# EAGLE design SE880_module_EFM32LG-STK3600 (EAGLE 6.4)
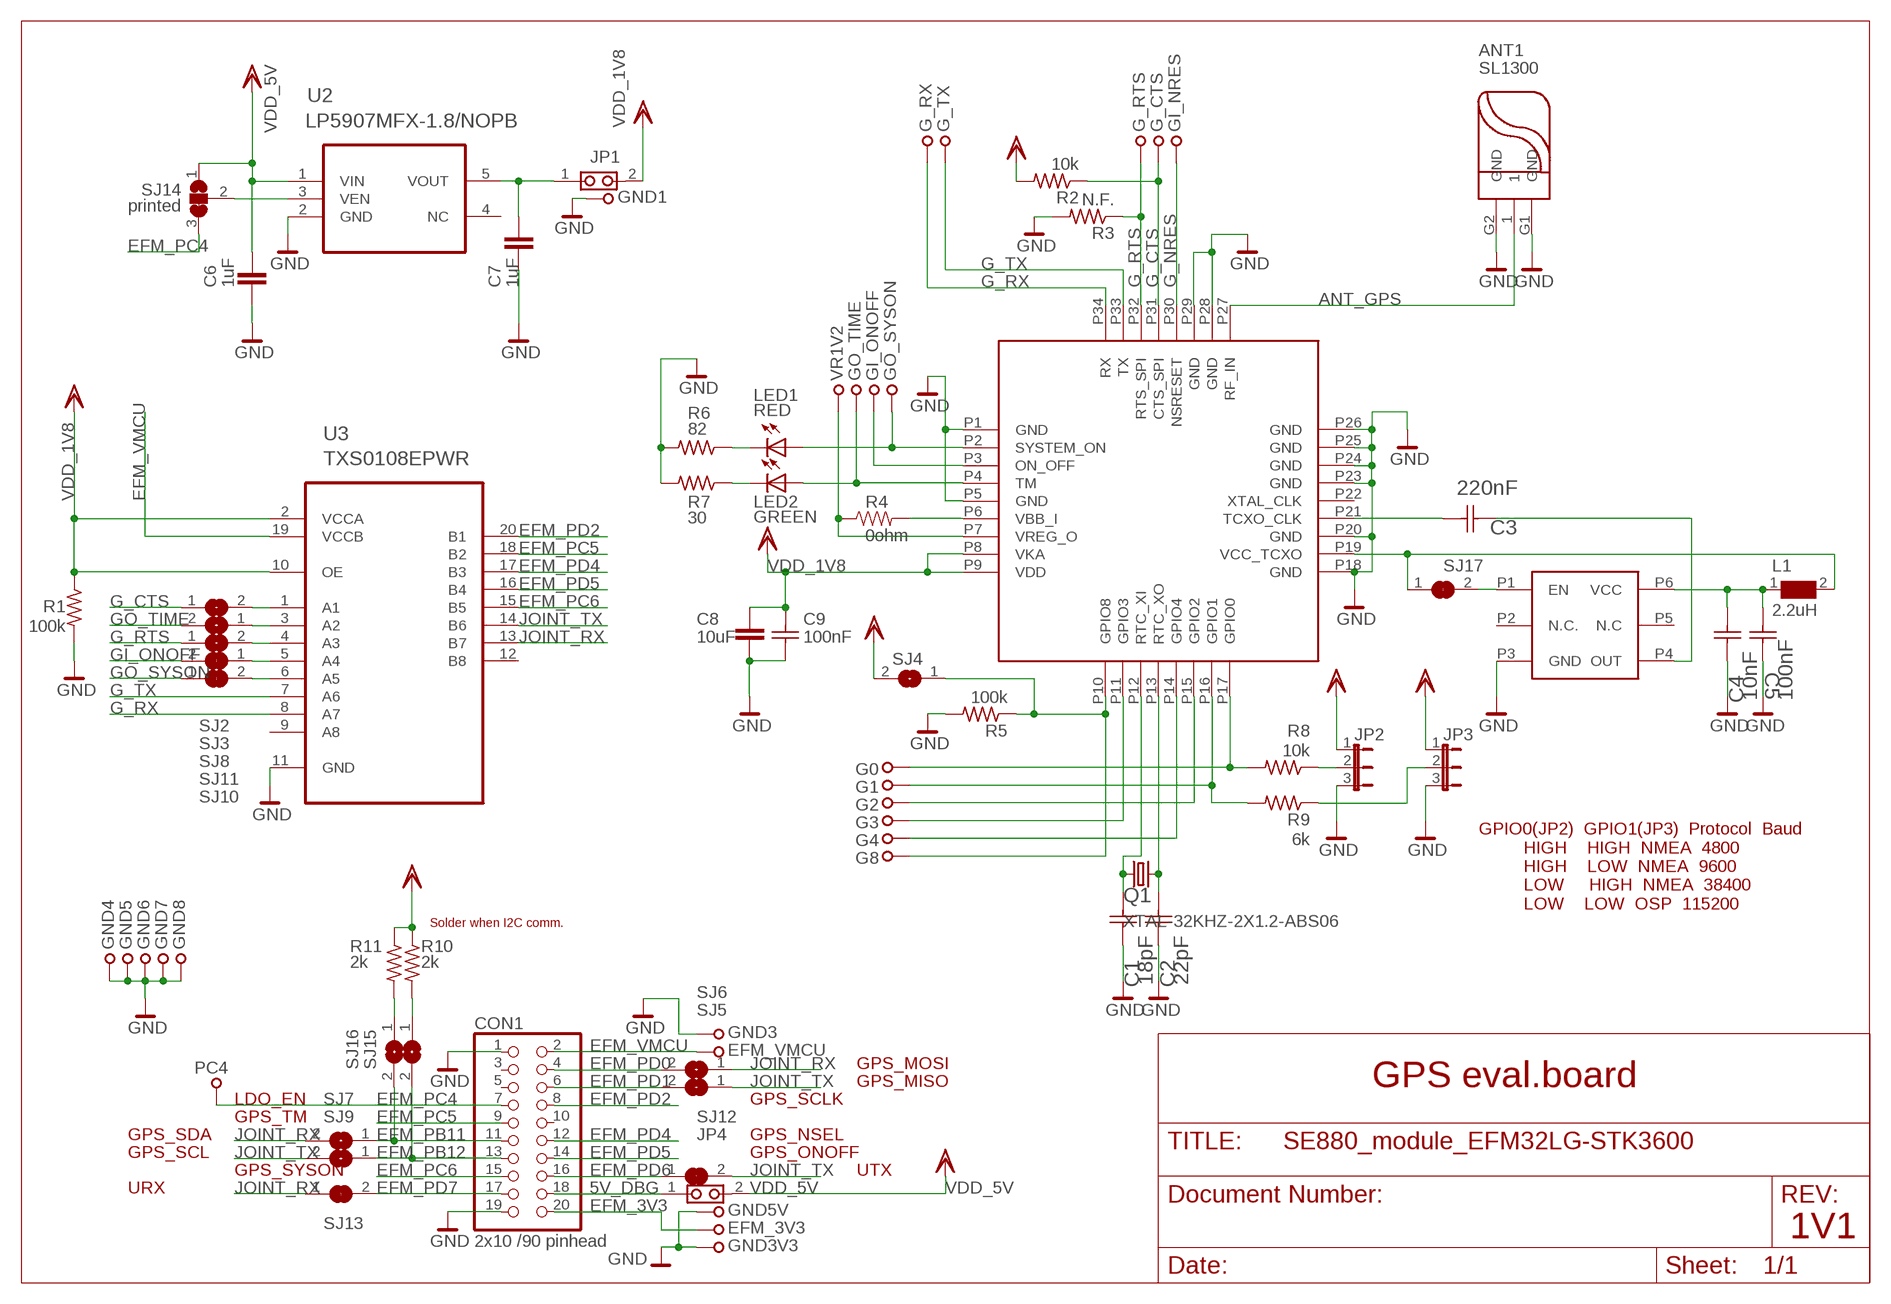
[diagram p0: schematic, sheet 1]

## Parts
ANT1  SL1300  [SL1300]
C1  18pF  CAP_GRM15  [CAPC1005X60N]
C2  22pF  CAP_GRM15  [CAPC1005X60N]
C3  220nF  CAP_GRM15  [CAPC1005X60N]
C4  10nF  CAP_GRM15  [CAPC1005X60N]
C5  100nF  CAP_GRM15  [CAPC1005X60N]
C6  1uF  CAP-SMD0603  [0603]
C7  1uF  CAP-SMD0603  [0603]
C8  10uF  CAP-SMD0603  [0603]
C9  100nF  CAP_GRM15  [CAPC1005X60N]
CON1  2x10 /90 pinhead  PINHD-2X10/90_FEMALE_EFM  [2X10/90_FEMALE_EFM_MUTANT]
EFM_3V3  TESTPOINT39MIL  [TESTPOINT1,0]
EFM_VMCU  TESTPOINT39MIL  [TESTPOINT1,0]
G0  TESTPOINT39MIL  [TESTPOINT1,0]
G1  TESTPOINT39MIL  [TESTPOINT1,0]
G2  TESTPOINT39MIL  [TESTPOINT1,0]
G3  TESTPOINT39MIL  [TESTPOINT1,0]
G4  TESTPOINT39MIL  [TESTPOINT1,0]
G8  TESTPOINT39MIL  [TESTPOINT1,0]
G_CTS  TESTPOINT39MIL  [TESTPOINT1,0]
G_RTS  TESTPOINT39MIL  [TESTPOINT1,0]
G_RX  TESTPOINT39MIL  [TESTPOINT1,0]
G_TX  TESTPOINT39MIL  [TESTPOINT1,0]
GI_NRES  TESTPOINT39MIL  [TESTPOINT1,0]
GI_ONOFF  TESTPOINT39MIL  [TESTPOINT1,0]
GND1  TESTPOINT39MIL  [TESTPOINT1,0]
GND3  TESTPOINT39MIL  [TESTPOINT1,0]
GND3V3  TESTPOINT39MIL  [TESTPOINT1,0]
GND4  TESTPOINT39MIL  [TESTPOINT1,0]
GND5  TESTPOINT39MIL  [TESTPOINT1,0]
GND5V  TESTPOINT39MIL  [TESTPOINT1,0]
GND6  TESTPOINT39MIL  [TESTPOINT1,0]
GND7  TESTPOINT39MIL  [TESTPOINT1,0]
GND8  TESTPOINT39MIL  [TESTPOINT1,0]
GO_SYSON  TESTPOINT39MIL  [TESTPOINT1,0]
GO_TIME  TESTPOINT39MIL  [TESTPOINT1,0]
JP1  JUMPER2-A  [PIN2-1R]
JP2  jumper 2mm  JP2E  [JP2]
JP3  jumper 2mm  JP2E  [JP2]
JP4  JUMPER2-A  [PIN2-1R]
L1  2.2uH  WE-KI_1008_B  [WE-KI_1008_B]
LED1  RED  LED0603  [LED-0603]
LED2  GREEN  LED0603  [LED-0603]
PC4  TESTPOINT39MIL  [TESTPOINT1,0]
Q1  XTAL-32KHZ-2X1.2-ABS06  [CRYSTAL-SMD-2X1.2-ABS06]
Q3  KT2520F16369ACW18TAN  TCXO-KT2520-16M369  [TCXO_2.5X2MM]
R1  100k  R-US_R0402  [R0402]
R2  10k  R-US_R0402  [R0402]
R3  N.F.  R-US_R0402  [R0402]
R4  0ohm  RESISTOR0603-RES  [0603-RES]
R5  100k  R-US_R0402  [R0402]
R6  82  R-US_R0402  [R0402]
R7  30  R-US_R0402  [R0402]
R8  10k  R-US_R0402  [R0402]
R9  6k  R-US_R0402  [R0402]
R10  2k  R-US_R0402  [R0402]
R11  2k  R-US_R0402  [R0402]
SJ2  printed  JUMPER_SMD  [JUMPER_SMD_SJ]
SJ3  printed  JUMPER_SMD  [JUMPER_SMD_SJ]
SJ4  printed  JUMPER_SMD  [JUMPER_SMD_SJ]
SJ5  printed  JUMPER_SMD  [JUMPER_SMD_SJ]
SJ6  printed  JUMPER_SMD  [JUMPER_SMD_SJ]
SJ7  printed  JUMPER_SMD  [JUMPER_SMD_SJ]
SJ8  printed  JUMPER_SMD  [JUMPER_SMD_SJ]
SJ9  printed  JUMPER_SMD  [JUMPER_SMD_SJ]
SJ10  printed  JUMPER_SMD_1  [JUMPER_SMD_SJ_1]
SJ11  printed  JUMPER_SMD_1  [JUMPER_SMD_SJ_1]
SJ12  printed  JUMPER_SMD_1  [JUMPER_SMD_SJ_1]
SJ13  printed  JUMPER_SMD_1  [JUMPER_SMD_SJ_1]
SJ14  printed  JUMPER_SMD_3A  [JUMPER_SMD_SJ2A]
SJ15  printed  JUMPER_SMD  [JUMPER_SMD_SJ]
SJ16  printed  JUMPER_SMD  [JUMPER_SMD_SJ]
SJ17  printed  JUMPER_SMD_1  [JUMPER_SMD_SJ_1]
U1  Telit SE880 GPS receiver  SE880  [LGA-34]
U2  LP5907MFX-1.8/NOPB  LP5907MFX-1.8/NOPB  [SOT-23/5-NEW]
U3  TXS0108EPWR  TXB0108PWR  [SOP65P640X120-20N]
VR1V2  TESTPOINT39MIL  [TESTPOINT1,0]

## Nets
5V_DBG: CON1.18 JP4.1(A)
ANT_GPS: ANT1.1 U1.P27(RF_IN)
EFM_3V3: CON1.20 EFM_3V3.1
EFM_PB11: CON1.11 SJ7.1 SJ16.2
EFM_PB12: CON1.13 SJ9.1 SJ15.2
EFM_PC4: CON1.7 PC4.1 SJ14.3
EFM_PC5: CON1.9 U3.18(B2)
EFM_PC6: CON1.15 U3.15(B5)
EFM_PD0: CON1.4 SJ6.2
EFM_PD1: CON1.6 SJ5.2
EFM_PD2: CON1.8 U3.20(B1)
EFM_PD4: CON1.12 U3.17(B3)
EFM_PD5: CON1.14 U3.16(B4)
EFM_PD6: CON1.16 SJ12.1
EFM_PD7: CON1.17 SJ13.2
EFM_VMCU: CON1.2 EFM_VMCU.1 U3.19(VCCB)
G_CTS: G_CTS.1 R2.1 SJ2.1 U1.P31(CTS_SPI)
G_NRES: GI_NRES.1 U1.P30(NSRESET)
G_RTS: G_RTS.1 R3.1 SJ8.1 U1.P32(RTS_SPI)
G_RX: G_RX.1 U1.P34(RX) U3.8(A7)
G_TX: G_TX.1 U1.P33(TX) U3.7(A6)
GI_ONOFF: GI_ONOFF.1 SJ11.2 U1.P3(ON_OFF)
GND: ANT1.G1(GND) ANT1.G2(GND) C1.2(C2) C2.2(C2) C4.2(C2) C5.2(C2) C6.1 C7.1 C8.1 C9.2(C2) CON1.1 CON1.19 GND1.1 GND3.1 GND3V3.1 GND4.1 GND5.1 GND5V.1 GND6.1 GND7.1 GND8.1 JP2.3 JP3.3 Q3.P3(GND) R1.2 R3.2 R5.2 R6.2 R7.2 U1.P1(GND) U1.P5(GND) U1.P18(GND) U1.P20(GND) U1.P23(GND) U1.P24(GND) U1.P25(GND) U1.P26(GND) U1.P28(GND) U1.P29(GND) U2.2(GND) U3.11(GND)
GO_SYSON: GO_SYSON.1 LED1.A SJ10.1 U1.P2(SYSTEM_ON)
GO_TIME: GO_TIME.1 LED2.A SJ3.2 U1.P4(TM)
JOINT_RX: SJ6.1 SJ7.2 SJ13.1 U3.13(B7)
JOINT_TX: SJ5.1 SJ9.2 SJ12.2 U3.14(B6)
N$1: C2.1(C1) Q1.P$2 U1.P13(RTC_XO)
N$2: C1.1(C1) Q1.P$1 U1.P12(RTC_XI)
N$3: C3.1(C1) U1.P21(TCXO_CLK)
N$4: C3.2(C2) Q3.P4(OUT)
N$5: C4.1(C1) C5.1(C1) L1.1 Q3.P6(VCC)
N$6: L1.2 SJ17.1 U1.P19(VCC_TCXO)
N$7: G3.1 U1.P11(GPIO3)
N$8: C7.2 JP1.1(A) U2.5(VOUT)
N$9: G4.1 U1.P14(GPIO4)
N$10: G2.1 U1.P15(GPIO2)
N$11: G1.1 R9.2 U1.P16(GPIO1)
N$12: G0.1 R8.2 U1.P17(GPIO0)
N$13: SJ14.2 U2.3(VEN)
N$14: Q3.P1(EN) SJ17.2
N$16: R10.2 SJ15.1
N$17: LED1.C R6.1
N$18: R11.2 SJ16.1
N$19: SJ2.2 U3.1(A1)
N$20: R4.2 U1.P6(VBB_I)
N$21: R4.1 U1.P7(VREG_O) VR1V2.1
N$22: G8.1 R5.1 SJ4.1 U1.P10(GPIO8)
N$23: LED2.C R7.1
N$24: JP2.2 R8.1
N$25: JP3.2 R9.1
N$26: SJ3.1 U3.3(A2)
N$27: SJ8.2 U3.4(A3)
N$28: SJ11.1 U3.5(A4)
N$29: SJ10.2 U3.6(A5)
VDD_1V8: C8.2 C9.1(C1) JP1.2(B) JP2.1 JP3.1 R1.1 R2.2 R10.1 R11.1 SJ4.2 U1.P8(VKA) U1.P9(VDD) U3.2(VCCA) U3.10(OE)
VDD_5V: C6.2 JP4.2(B) SJ14.1 U2.1(VIN)
Unconnected: CON1.3 CON1.5 CON1.10 Q3.P2(N.C.) Q3.P5(N.C) U1.P22(XTAL_CLK) U2.4(NC) U3.9(A8) U3.12(B8)

## Notes on the sheet
- GPIO0(JP2)  GPIO1(JP3)  Protocol  Baud 
           HIGH    HIGH  NMEA  4800 
           HIGH    LOW  NMEA  9600 
           LOW     HIGH  NMEA  38400 
           LOW    LOW  OSP  115200
- Solder when I2C comm.
- GPS_MOSI
- GPS_MISO | GPS eval.board
- LDO_EN | GPS_SCLK
- GPS_TM
- GPS_SDA | GPS_NSEL
- GPS_SCL | GPS_ONOFF
- GPS_SYSON | UTX
- URX
- 1V1

## Library data of the parts
ANT1 = dzo:SL1300: Sarantel SL1300 helical GPS antenna. Glue needed for stable moutning!
C1-C5 C9 = dzo:CAP_GRM15: Murata GRM15 series 0402 size capacitor; MURATA: GRM15 series
C6-C8 = lve_modositott:CAP-SMD
CON1 = dzo:PINHD-2X10: PIN HEADER
EFM_3V3 EFM_VMCU G0 G1-G4 G8 G_CTS G_RTS G_RX G_TX GI_NRES GI_ONOFF GND1 GND3 GND3V3 GND4 GND5 GND5V GND6-GND8 GO_SYSON GO_TIME PC4 VR1V2 = lve_modositott:TESTPOINT
JP1 JP4 = lve:JUMPER2-A
JP2 JP3 = jumper:JP2E: JUMPER
L1 = Wuerth_Elektronik:WE-KI: SMD Wire Wound Ceramic Inductor WE-KI - Wire wound - High thermal stability - Rated current up to 1 A - High Q-factor - High SRF -- Especially developed for high frequency applications -- Perfect for applications in telecommunications -- Bluetooth -- Wireless LAN
LED1 LED2 = Pinoccio:LED: LEDs Standard schematic elements and footprints for 5mm, 3mm, 1206, and 0603 sized LEDs. 5mm - Spark Fun Electronics SKU : COM-00529 (and others)
Q1 = dzo:XTAL-32KHZ-2X1.2-ABS06: 32.768kHz xtal
Q3 = dzo:TCXO-KT2520-16M369: Temperature Compensated Crystal Oscillators (TCXO) Surface Mount Type TCXO (LSI Type) KT2520 Series for GPS; DISTRI: Mouser; DISTRINR: 581-KT2520F16ACW18T; PARTNR: KT2520F16369ACW18TAN; VENDOR: AVX-Kyocera
R1-R3 R5-R11 = resistor:R-US_: RESISTOR, American symbol
R4 = dzo:RESISTOR: Resistor Basic schematic elements and footprints for 0603, 1206, and PTH resistors.
SJ2-SJ9 SJ15 SJ16 = lve:JUMPER_SMD
SJ10-SJ13 SJ17 = lve_modositott:JUMPER_SMD_1
SJ14 = lve_modositott:JUMPER_SMD_3A
U1 = dzo:SE880: Telit GPS chip size module SE880; DISTRI: Digikey; DISTRINR: 943-1019-1-ND; PARTNR: SE880GPSR22R001; VENDOR: Telit
U2 = dzo:LP5907MFX-1.8/NOPB; PACKAGE: SOT-23
U3 = dzo:TXB0108PWR: 8-BIT BIDIRECTIONAL VOLTAGE-LEVEL TRANSLATOR; PACKAGE: TSSOP-20; SUPPLIER: Texas Instruments

## Board
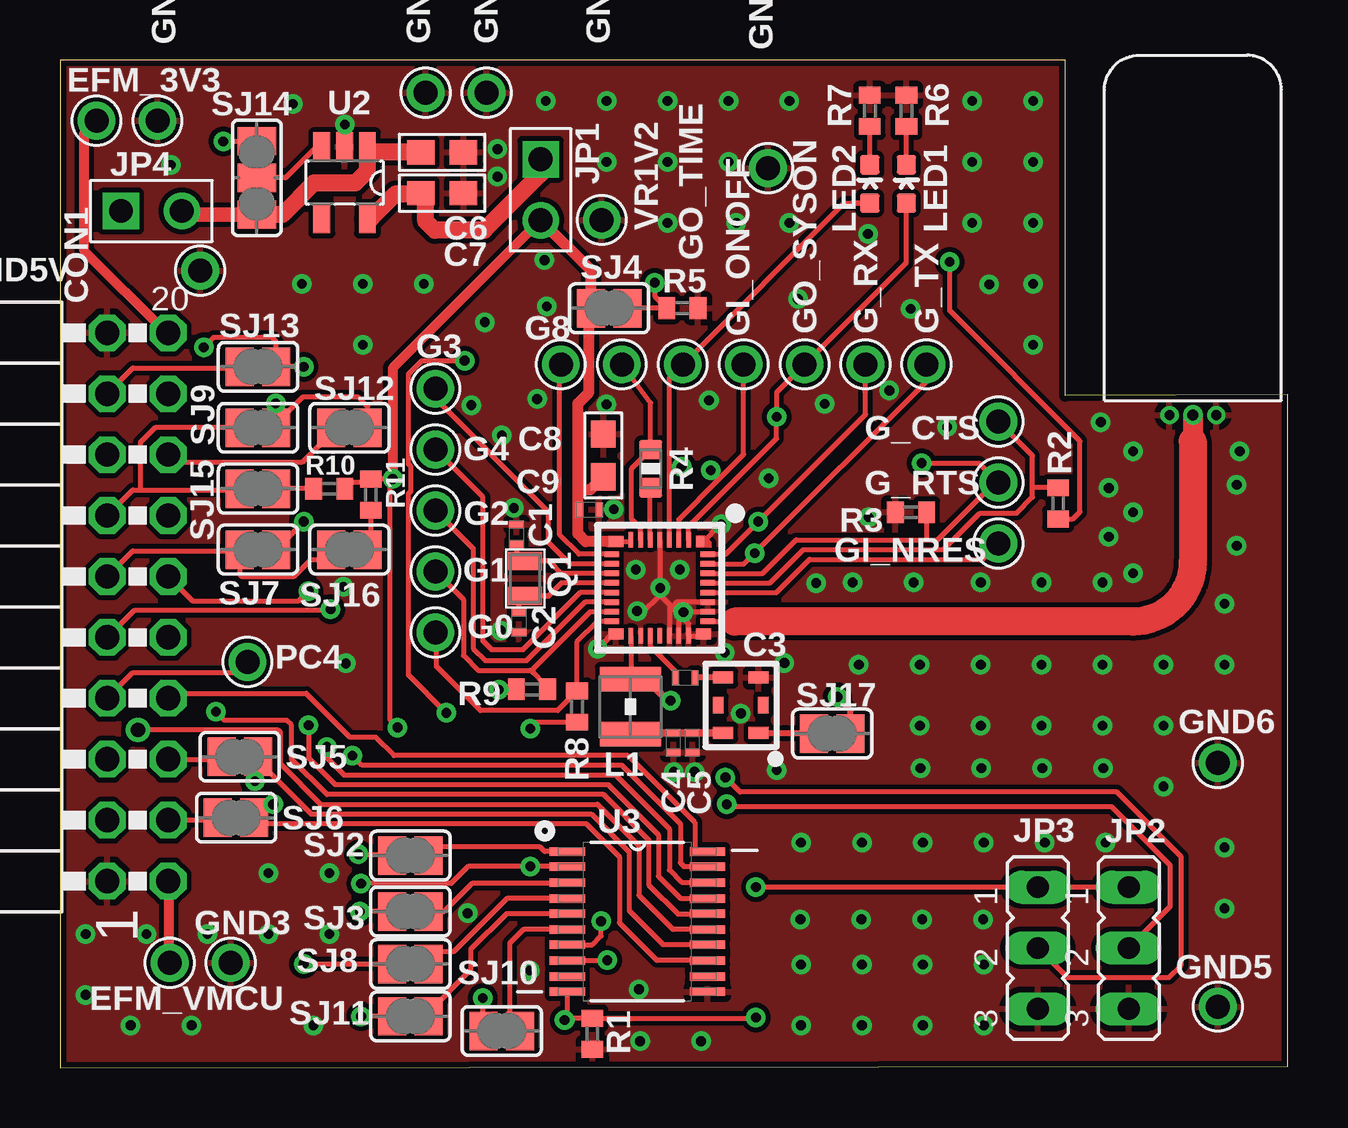
[diagram p1: board, top side]
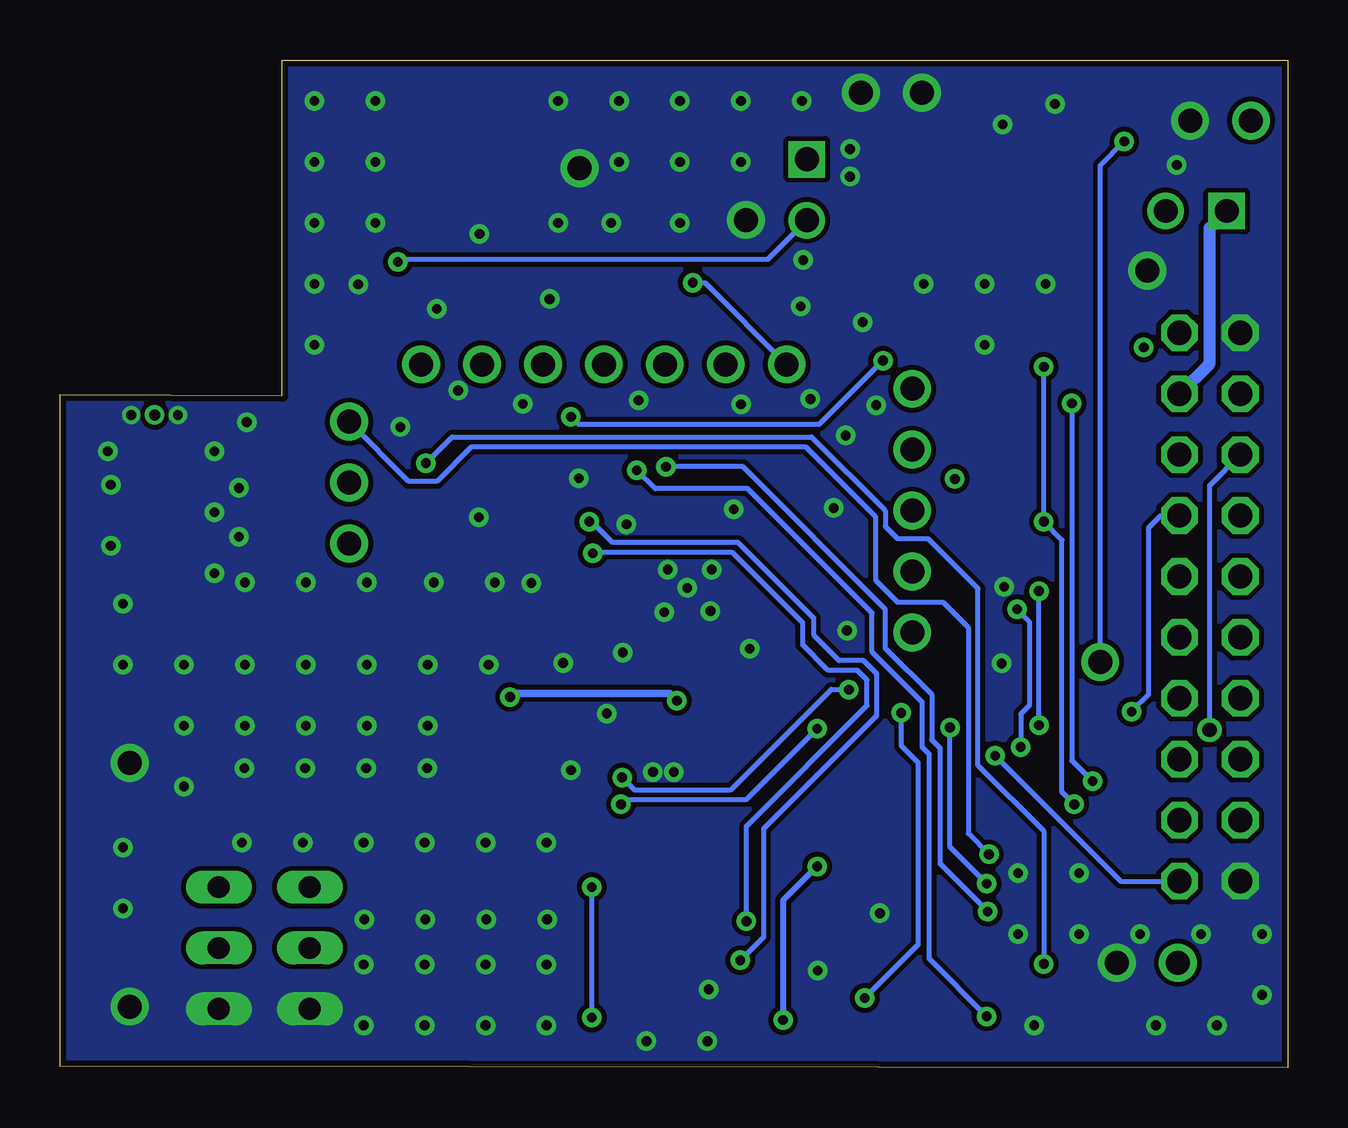
[diagram p2: board, bottom side, seen from below]

Size 51.17 x 42 mm. Coordinates in mm from the lower left corner, seen from the top.
Outline: 0,0 51.17,0.05 51.17,28.06 41.9,28.01 41.9,42 0,42 0,0
Copper layers (1*16): Top 0.0356mm / dielectric 1.5mm / Bottom 0.0356mm
Design rules "default_INTEGRATION *": minimum track width 6mil, minimum drill 16mil, track to track 8mil, track to pad 6mil, pad to pad 6mil, via to via 8mil, smd to smd 0mil, copper to edge 10mil, drill to drill 8mil, minimum pad ring 7mil, minimum via ring 8mil, stop-mask expansion 4mil, vias tented up to drill 24mil, thermal gap 10mil
tKeepout: area 23.4,18.5 to 26.7,21.6
bKeepout: area 27.4,17.8 to 48,27.4

### Footprints (pad centres in the part's own frame; a part is rotated, then mirrored left to right if it is on the bottom)
SL1300 = drill 0.45 pad 0.813: 1 0,0 | drill 0.406 pad 0.711: G1 0.975,0; G2 -0.975,0
CAPC1005X60N = smd 0.305 x 0.61: 1 -0.406,0; 2 0.406,0
0603 = smd 1.143 x 1.016: 1 -0.889,0; 2 0.889,0
2X10/90_FEMALE_EFM_MUTANT = drill 1.016 octagon: 1 -11.43,-1.27; 2 -11.43,-3.81; 3 -8.89,-1.27; 4 -8.89,-3.81; 5 -6.35,-1.27; 6 -6.35,-3.81; 7 -3.81,-1.27; 8 -3.81,-3.81; 9 -1.27,-1.27; 10 -1.27,-3.81; 11 1.27,-1.27; 12 1.27,-3.81; 13 3.81,-1.27; 14 3.81,-3.81; 15 6.35,-1.27; 16 6.35,-3.81; 17 8.89,-1.27; 18 8.89,-3.81; 19 11.43,-1.27; 20 11.43,-3.81
TESTPOINT1,0 = drill 1 pad 1.575: 1 0,0
PIN2-1R = drill 0.991 pad 1.524 square: 1 0,0 | drill 0.991 pad 1.524: 2 2.54,0
JP2 = drill 0.914 long: 1 -2.54,0; 2 0,0; 3 2.54,0
WE-KI_1008_B = smd 1.02 x 2.54: 1 -1.145,0; 2 1.145,0
LED-0603 = smd 0.8 x 0.8: A 0,-0.8; C 0,0.8
CRYSTAL-SMD-2X1.2-ABS06 = smd 0.75 x 1.4: P$1 -0.725,0; P$2 0.725,0
TCXO_2.5X2MM = smd 0.5 x 0.825: P1 -1.15,-0.738; P3 1.15,-0.738; P4 1.15,0.738; P6 -1.15,0.738 | smd 0.7 x 0.43: P2 0,-0.935; P5 0,0.935
R0402 = smd 0.7 x 0.9: 1 -0.65,0; 2 0.65,0
0603-RES = smd 0.8 x 0.95: 1 -0.8,0; 2 0.8,0
JUMPER_SMD_SJ = smd 1.168 x 1.6: 1 -0.762,0; 2 0.762,0
JUMPER_SMD_SJ_1 = smd 1.168 x 1.6: 1 -0.762,0; 2 0.762,0
JUMPER_SMD_SJ2A = smd 1.168 x 1.6: 1 -1.524,0; 2 0,0; 3 1.524,0
LGA-34 = smd 0.45 x 0.379: P1 -1.925,1.695 | smd 0.6 x 0.2: P2 -2,1.2; P3 -2,0.8; P4 -2,0.4; P5 -2,0; P6 -2,-0.4; P7 -2,-0.8; P8 -2,-1.2; P19 2,-1.2; P20 2,-0.8; P21 2,-0.4; P22 2,0; P23 2,0.4; P24 2,0.8; P25 2,1.2 | smd 0.45 x 0.65: P9 -1.925,-1.825; P18 1.925,-1.825; P26 1.925,1.825 | smd 0.2 x 0.6: P10 -1.4,-2; P11 -1,-2; P12 -0.6,-2; P13 -0.2,-2; P14 0.2,-2; P15 0.6,-2; P16 1,-2; P17 1.4,-2; P27 1.4,2; P28 1,2; P29 0.6,2; P30 0.2,2; P31 -0.2,2; P32 -0.6,2; P33 -1,2; P34 -1.4,2
SOT-23/5-NEW = smd 0.7 x 1.2: 1 -0.95,-1.5; 2 0,-1.5; 3 0.95,-1.5; 4 0.95,1.5; 5 -0.95,1.5
SOP65P640X120-20N = smd 1.473 x 0.356: 1 -2.921,2.921; 2 -2.921,2.286; 3 -2.921,1.626; 4 -2.921,0.965; 5 -2.921,0.33; 6 -2.921,-0.33; 7 -2.921,-0.965; 8 -2.921,-1.626; 9 -2.921,-2.286; 10 -2.921,-2.921; 11 2.921,-2.921; 12 2.921,-2.286; 13 2.921,-1.626; 14 2.921,-0.965; 15 2.921,-0.33; 16 2.921,0.33; 17 2.921,0.965; 18 2.921,1.626; 19 2.921,2.286; 20 2.921,2.921

### Placement (x,y rotation side)
ANT1  47.22,27.2 0 top
C1  19.03,22.23 90 top
C2  19.13,18.56 270 top
C3  26.06,16.25 0 top
C4  25.56,13.54 270 top
C5  26.36,13.54 270 top
C6  15.93,38.15 180 top
C7  15.93,36.45 180 top
C8  22.65,25.52 270 top
C9  22.07,23.26 0 top
CON1  0.7,19.2 90 top
EFM_3V3  1.52,39.47 270 top
EFM_VMCU  4.57,4.37 0 top
G0  15.65,18.14 0 top
G1  15.65,20.68 0 top
G2  15.65,23.22 0 top
G3  15.65,28.3 0 top
G4  15.65,25.76 0 top
G8  20.88,29.31 0 top
G_CTS  39.12,26.92 180 top
G_RTS  39.12,24.38 180 top
G_RX  33.58,29.31 270 top
G_TX  36.12,29.31 270 top
GI_NRES  39.12,21.84 180 top
GI_ONOFF  28.5,29.31 270 top
GND1  22.58,35.33 0 top
GND3  7.11,4.37 0 top
GND3V3  4.06,39.47 270 top
GND4  29.51,37.49 0 top
GND5  48.26,2.54 0 top
GND5V  5.84,33.22 0 top
GND6  48.26,12.7 0 top
GND7  15.24,40.64 0 top
GND8  17.78,40.64 0 top
GO_SYSON  31.04,29.31 270 top
GO_TIME  25.96,29.31 270 top
JP1  20.04,37.86 270 top
JP2  44.55,4.98 270 top
JP3  40.76,4.98 270 top
JP4  2.54,35.7 0 top
L1  23.78,15.04 90 top
LED1  35.28,36.83 0 top
LED2  33.76,36.83 0 top
PC4  7.81,16.91 180 top
Q1  19.39,20.38 270 top
Q3  28.38,15.1 90 top
R1  22.19,1.41 270 top
R2  41.61,23.52 270 top
R3  35.47,23.15 180 top
R4  24.62,24.96 270 top
R5  25.94,31.66 0 top
R6  35.28,39.88 90 top
R7  33.76,39.88 90 top
R8  21.55,15.05 90 top
R9  19.67,15.77 0 top
R10  11.23,24.13 180 top
R11  12.95,23.88 270 top
SJ2  14.61,8.84 0 top
SJ3  14.61,6.5 180 top
SJ4  22.89,31.65 180 top
SJ5  7.49,12.95 180 top
SJ6  7.34,10.41 180 top
SJ7  8.26,21.59 0 top
SJ8  14.61,4.32 0 top
SJ9  8.26,26.67 0 top
SJ10  18.41,1.52 0 top
SJ11  14.61,2.13 180 top
SJ12  12.06,26.67 0 top
SJ13  8.26,29.21 180 top
SJ14  8.2,37.08 90 top
SJ15  8.26,24.13 180 top
SJ16  12.06,21.59 180 top
SJ17  32.19,13.92 180 top
U1  25,20 270 top
U2  11.86,36.88 180 top
U3  24.07,6.09 0 top
VR1V2  23.42,29.31 270 top

### Tracks (layer width: path | path; a pad name or v marks a point on that pad's centre or on a via)
5V_DBG
  Bottom 0.508: CON1.18 3.25,29.35 3.25,34.99 JP4.1
ANT_GPS
  Top 0.203: U1.P27 28.26,18.6 28.12,18.59
  Top 0.838: ANT1.1 47.22,26.11
  Top 1.168: 47.22,26.11 47.22,21.08 arc-90 44.73,18.59 28.12,18.59
EFM_3V3
  Top 0.406: CON1.20 4.42,30.63 1.02,34.04 1.02,38.96 EFM_3V3.1
EFM_PB11
  Top 0.203: CON1.11 3.04,21.54 7.44,21.54 SJ7.1 7.49,20.55 7.57,20.47 9.75,20.47 10.46,21.18 11.02,21.18 11.3,21.46 SJ16.2
EFM_PB12
  Top 0.203: CON1.13 3.04,24.08 3.4,24.08 | 3.4,24.08 7.44,24.08 SJ15.2 | SJ9.1 3.96,26.67 3.35,26.06 3.35,24.13 3.4,24.08
EFM_PC4  (via drill 0.41)
  Top 0.203: v6.81,38.61 SJ14.3 | CON1.7 3.04,16.46 7.36,16.46 PC4.1
  Bottom 0.203: PC4.1 7.81,37.6 v6.81,38.61
EFM_PC5  (via drill 0.41)
  Top 0.203: CON1.9 3.09,19.05 11.23,19.05 v11.28,19.1 | v11.12,13.36 11.12,12.9 11.84,12.19 23.16,12.19 25.4,9.96 25.4,8.23 25.91,7.72 26.98,7.72 U3.18
  Bottom 0.203: v11.28,19.1 10.77,18.59 10.77,15.09 11.12,14.73 v11.12,13.36
EFM_PC6  (via drill 0.6)
  Top 0.203: U3.15 25.55,5.75 24.13,7.18 24.13,9.25 22.4,10.97 10.87,10.97 9.2,12.65 9.2,13.97 9.09,14.07 v3.25,14.07
  Bottom 0.203: CON1.15 3.25,24.27 v3.25,14.07
EFM_PD0
  Top 0.203: SJ6.2 6.63,10.31 CON1.4
EFM_PD1
  Top 0.203: CON1.6 6.73,12.85 SJ5.2
EFM_PD2
  Top 0.203: CON1.8 4.72,15.6 10.26,15.6 12.09,13.77 13.16,13.77 13.92,13.01 23.67,13.01 26.47,10.21 26.47,8.99 26.48,9.01 U3.20
EFM_PD4  (via drill 0.41)
  Top 0.203: v10.36,14.28 10.36,12.9 11.48,11.79 22.86,11.79 24.94,9.7 24.94,7.98 25.86,7.06 26.98,7.06 U3.17 | CON1.12 5.52,19.46 9.96,19.46 v10.36,19.86
  Bottom 0.203: v10.36,14.28 v10.36,19.86
EFM_PD5  (via drill 0.41)
  Top 0.203: v6.5,14.83 6.86,14.48 9.45,14.48 9.65,14.28 9.65,12.85 11.12,11.38 22.66,11.38 24.54,9.5 24.54,7.62 25.76,6.4 26.97,6.4 U3.16
  Bottom 0.203: CON1.14 5.29,23.01 5.79,22.5 5.79,15.54 v6.5,14.83
EFM_PD6
  Top 0.203: CON1.16 4.81,25.25 10.11,25.25 10.92,26.06 10.92,26.29 SJ12.1
EFM_PD7
  Top 0.203: CON1.17 3.04,29.16 7.44,29.16 SJ13.2
EFM_VMCU  (via drill 0.41)
  Top 0.203: v12.19,13.01 12.6,12.6 23.42,12.6 25.86,10.16 25.86,8.53 26.01,8.38 26.98,8.38 U3.19 | 4.53,7.75 CON1.2
  Top 0.406: 4.53,7.75 4.53,4.41 EFM_VMCU.1
  Bottom 0.203: v12.19,13.01 6.96,7.77 CON1.2
G_CTS  (via drill 0.41)
  Top 0.203: U1.P31 29.6,20.2 30.99,21.59 36.83,21.59 38.35,23.11 39.88,23.11 40.54,23.77 40.54,24.23 | 40.54,24.23 40.54,25.5 G_CTS.1 | R2.1 40.6,24.17 40.54,24.23 | v12.45,8.89 13.79,8.89 SJ2.1
  Bottom 0.203: v12.45,8.89 13.31,9.75 13.31,18.34 14.38,19.41 16.26,19.41 17.17,20.32 17.17,22.96 20.07,25.86 34.04,25.86 35.46,24.43 36.63,24.43 G_CTS.1
G_NRES
  Top 0.203: GI_NRES.1 38.46,21.18 31.24,21.18 29.86,19.8 U1.P30
G_RTS  (via drill 0.41)
  Top 0.203: U1.P32 29.29,20.6 30.68,22 36.12,22 | 36.12,22 36.58,22 38.96,24.38 G_RTS.1 38.3,25.2 v35.92,25.2 | R3.1 36.12,22 | v10.16,4.32 SJ8.1
  Bottom 0.203: v10.16,4.32 10.16,9.86 12.9,12.6 12.9,19.96 14.99,22.05 16.26,22.05 16.76,22.55 16.76,23.22 19.84,26.29 34.82,26.29 v35.92,25.2
G_RX  (via drill 0.41)
  Top 0.203: U1.P34 27.75,21.4 v29.11,22.76 33.58,27.23 G_RX.1 | U3.8 22.8,4.46 v22.81,4.47
  Bottom 0.203: v22.81,4.47 21.84,5.44 21.84,9.96 17.12,14.68 17.12,16.41 17.68,16.97 18.69,16.97 19.76,18.03 19.76,18.75 22.91,21.89 28.14,21.89 29.01,22.76 v29.11,22.76
G_TX  (via drill 0.41)
  Top 0.203: U1.P33 28.52,21 v28.96,21.44 36.12,28.6 G_TX.1 | U3.7 22.19,5.12 22.55,5.49 v22.55,6.1
  Bottom 0.203: v28.96,21.44 28.91,21.49 23.16,21.49 20.22,18.54 20.22,17.63 19.15,16.56 17.93,16.56 17.53,16.15 17.53,15.09 22.55,10.06 v22.55,6.1
GI_ONOFF  (via drill 0.41)
  Top 0.203: SJ11.2 v12.55,2.13 | U1.P3 25.8,22.85 27.46,24.51 | 27.46,24.51 28.5,25.55 GI_ONOFF.1 | v27.13,24.89 27.46,24.56 27.46,24.51
  Bottom 0.203: v12.55,2.13 14.94,4.52 14.94,13.06 15.24,13.36 15.24,15.24 17.32,17.32 17.32,18.95 22.5,24.13 26.36,24.13 v27.13,24.89
GND  (via drill 0.41)
  Top 0.152: 24.05,18.92 v24.05,19.03 | U1.P1 26.72,21.95
  Top 0.203: U1.P5 25,19.7 | 25,19.7 25.4,19.3 | 25.4,19.3 U1.P23 | 24.2,18.9 25,19.7 | U1.P24 25.8,18.9 | 25.8,18.9 25.7,19 | 25.7,19 25.5,19.2 | 25.5,19.2 25.4,19.3 | 25.8,18.9 26.2,18.5 U1.P25 26.82,18 U1.P26 | U1.P28 25.71,19 25.7,19 | U1.P29 25.7,19.4 25.5,19.2 | 26.76,21.87 26.78,21.87 v27.56,22.65
  Top 0.254: U1.P18 23.04,18.07 v22.42,17.46
  other vias: 49.18,25.68 44.73,25.68 33.71,22.94 24,20.76 25.83,20.76 25.99,18.98 25.02,19.99 18.24,37.14 18.24,38.28 48.54,16.79 18.92,23.33 48.54,19.33 44.73,23.14 44.73,20.6 49.05,21.75 49.05,24.29 46,14.25 46,16.79 43.46,14.25 43.46,16.79 40.92,14.25 40.92,16.79 38.38,14.25 38.38,16.79 30.76,32.03 35.84,14.25 35.84,16.79 38.38,20.22 35.59,20.22 33.05,20.22 36.98,26.7 33.3,16.79 23.08,23.28 43.71,22.13 43.71,24.16 26.45,12.32 25.59,12.32 11.88,39.31 9.7,40.16 30.2,16.86 18.37,18.22 22.78,27.64 28.38,14.76 20.19,33.66 20.3,31.73 17.7,31.07 18.42,26.34 17.15,27.61 19.89,27.87 29.54,24.57 31.88,27.66 27.05,27.82 34.57,28.22 31.52,20.2 27.71,17.3 11.91,16.84 11.81,20.04 46,11.71 35.87,12.48 38.41,12.48 40.95,12.48 43.49,12.48 43.59,9.38 41.05,9.38 38.51,9.38 35.97,9.38 33.43,9.38 30.89,9.38 29.87,12.4 30.89,4.3 33.43,4.3 35.97,4.3 38.51,4.3 38.51,1.76 35.97,1.76 33.43,1.76 30.89,1.76 30.86,6.18 33.4,6.18 35.94,6.18 38.48,6.18 48.54,9.17 48.54,6.63 40.92,20.22 43.46,20.22 43.38,26.9 40.56,30.13 40.56,32.67 40.56,35.21 40.56,37.75 40.56,40.29 38.02,40.29 38.02,37.75 38.02,35.21 38.74,32.64 35.46,31.63 33.68,34.75 30.41,40.29 27.86,40.29 25.32,40.29 22.79,40.29 20.25,40.29 27.86,37.75 28.2,35.21 30.41,35.21 25.32,35.21 25.32,37.75 22.79,37.75 15.16,32.67 12.62,32.67 10.09,32.67 12.62,30.13 4.62,37.62 24.13,3.26 24.18,1.1 26.72,1.1 11.23,5.57 11.23,8.11 8.69,8.11 8.69,5.57 6.15,5.57 3.61,5.57 1.07,5.57 1.07,3.03 10.57,1.76 5.49,1.76 2.95,1.76 16.99,6.43 19.58,4.04
  pour Bottom (rank 2, no thermals): 51.17,28.05 51.17,0.05 0,0 0,42 41.9,42 41.9,28
  pour Top (rank 2): 51.17,28.05 51.17,0.05 0,0 0,42 41.9,42 41.9,28
  pour Top (no thermals): 23.57,21.44 26.42,21.44 26.42,18.54 23.57,18.54
GO_SYSON  (via drill 0.41)
  Top 0.203: LED1.A 35.28,33.55 GO_SYSON.1 29.87,28.14 v29.87,27.13 | SJ10.1 17.63,1.55 v17.63,2.9 | v16.1,14.78 14.53,16.36 14.53,23.93 14.63,24.03 14.63,25.04 14.53,25.15 14.53,28.91 15.09,29.46 v16.87,29.46 | v29.87,27.13 29.82,27.13 | U1.P2 26.2,22.54 29.87,26.21 v29.87,27.13
  Bottom 0.203: v17.63,2.9 15.39,5.13 15.39,12.7 16.1,13.41 v16.1,14.78 | v16.87,29.46 19.51,26.82 29.57,26.82 v29.87,27.13
GO_TIME  (via drill 0.41)
  Top 0.203: U1.P4 25.4,25.04 | 25.4,25.04 25.4,28.75 GO_TIME.1 32.68,36.03 LED2.A 32.98,36.03 | SJ3.2 v12.5,6.5 | v25.91,25.04 25.4,25.04
  Bottom 0.203: v12.5,6.5 14.48,8.48 14.48,13.31 14.83,13.66 14.83,15.54 16.76,17.48 16.76,19.1 22.71,25.04 v25.91,25.04 25.76,25.04
JOINT_RX  (via drill 0.41)
  Top 0.203: U3.13 24.89,4.46 23.32,6.04 23.32,8.79 21.95,10.16 8.51,10.16 SJ6.1 8.33,10.41 v8.89,10.97 | v5.99,30.02 6.4,30.43 8.84,30.43 9.02,30.25 SJ13.1 v10.16,29.21 | SJ7.2 10.16,22.73 v10.16,22.76
  Bottom 0.203: v10.16,29.21 v10.16,22.76 9.4,22 9.4,11.48 v8.89,10.97
JOINT_TX  (via drill 0.41)
  Top 0.203: U3.14 25.15,5.12 23.72,6.54 23.72,8.99 22.15,10.57 10.46,10.57 8.51,12.52 | 8.51,12.52 8.26,12.78 SJ5.1 | SJ12.2 12.83,27.56 12.45,27.94 10.11,27.94 9.02,26.85 SJ9.2 8.99,26.7 v8.99,27.69 | v8.13,11.94 8.13,12.14 8.51,12.52
  Bottom 0.203: v8.99,27.69 8.99,12.8 v8.13,11.94
N$1
  Top 0.203: 19.96,19.91 19.64,19.91 Q1.P$2 | C2.1 19.13,19.4 Q1.P$2 | U1.P13 20.91,20.2 20.37,19.66 20.22,19.66 20.37,19.66 Q1.P$2
N$2
  Top 0.203: U1.P12 20.9,20.6 20.4,21.11 Q1.P$1 | 19.66,20.83 Q1.P$1 | C1.1 19.03,21.46 Q1.P$1
N$3
  Top 0.203: U1.P21 24.6,17.56 25.66,16.51 C3.1
N$4
  Top 0.254: Q3.P4 C3.2
N$5
  Top 0.254: 23.77,14.1 L1.1
  Top 0.305: Q3.P6 C5.1 26.41,13.95 C4.1 23.83,13.95 L1.1
N$6  (via drill 0.41)
  Top 0.203: U1.P19 23.8,16.18 L1.2
  Top 0.254: 23.8,16.18 24.46,16.18 | SJ17.1 32.95,14.9 v32.41,15.44
  Top 0.305: v25.45,15.29 25.35,15.29 24.46,16.18
  Bottom 0.305: v25.45,15.29 25.76,15.6 32.26,15.6 v32.41,15.44
N$7
  Top 0.203: U1.P11 21.27,21 20.37,21.89 20.37,23.16 15.65,27.89 G3.1
N$8
  Top 0.711: JP1.1 20.04,37.26 17.68,34.9 15.62,34.9 15.24,35.28 15.24,36.25 C7.2 15.01,36.42 13.99,36.42 12.95,35.38 U2.5
N$9
  Top 0.203: U1.P14 21.68,19.8 19.3,17.42 17.98,17.42 17.63,17.78 17.63,23.77 G4.1
N$10
  Top 0.203: U1.P15 21.89,19.4 19.46,16.97 17.73,16.97 17.22,17.48 17.22,21.64 G2.1
N$11
  Top 0.203: G1.1 16.82,19.51 16.82,17.17 17.42,16.56 19.61,16.56 19.71,16.46 | 19.71,16.46 20.15,16.02 R9.2 | U1.P16 22.1,19 19.71,16.61 19.71,16.46
N$12
  Top 0.203: U1.P17 22.41,18.6 21.54,17.73 R8.2 20.74,14.88 17.53,14.88 15.7,16.71 15.7,18.09 G0.1
N$13
  Top 0.152: U2.3 10.91,38.14
  Top 0.203: U2.3 10.7,38.38 9.4,37.08 SJ14.2
N$14
  Top 0.254: 29.01,13.96 Q3.P1 31.4,13.95 SJ17.2
N$16
  Top 0.203: R10.2 SJ15.1
N$17
  Top 0.203: LED1.C R6.1
N$18
  Top 0.203: R11.2 12.95,21.72 SJ16.1
N$19
  Top 0.203: U3.1 20.2,9.01 20.02,9.2 15.72,9.2 SJ2.2
N$20
  Top 0.203: U1.P6 24.6,24.14 R4.2
N$21
  Top 0.203: U1.P7 24.2,22.48 23.82,22.86 23.82,24.96 R4.1 24.62,27.7 VR1V2.1
N$22  (via drill 0.41)
  Top 0.203: SJ4.1 R5.1 24.79,32.16 v24.79,32.72 | U1.P10 21.63,21.4 20.83,22.2 20.83,29.26 G8.1
  Bottom 0.203: v24.79,32.72 24.28,32.72 G8.1
N$23
  Top 0.203: LED2.C R7.1
N$24  (via drill 0.41)
  Top 0.203: JP2.2 46.28,6.71 46.28,8.43 43.84,10.87 27.89,10.87 v27.79,10.97 | R8.1 19.88,14.4 v19.61,14.12
  Bottom 0.203: v27.79,10.97 27.58,11.18 22.55,11.18 v19.61,14.12
N$25  (via drill 0.41)
  Top 0.203: JP3.2 41.98,3.76 46.23,3.76 46.74,4.27 46.74,8.79 44.04,11.48 28.35,11.48 v27.74,12.09 | R9.1 19,15.75 v18.29,15.75
  Bottom 0.203: v27.74,12.09 27.23,11.58 23.2,11.58 R9.1 | R9.1 18.2,15.77 v18.29,15.75 19,15.75 R9.1
N$26
  Top 0.203: U3.3 21.11,7.67 17.17,7.67 16,6.5 SJ3.1
N$27
  Top 0.203: U3.4 18.63,7.05 16.41,4.83 15.49,4.83 15.49,4.45 SJ8.2
N$28
  Top 0.203: U3.5 18.61,6.42 17.12,4.93 17.12,4.06 15.37,2.31 SJ11.1
N$29
  Top 0.203: SJ10.2 18.75,1.96 18.75,5.18 19.32,5.75 U3.6
VDD_1V8  (via drill 0.41)
  Top 0.203: U1.P9 23.8,21.93 U1.P8 | JP2.1 JP3.1 v29.01,7.52 | R10.1 12.13,24.38 12.7,24.38 12.84,24.53 R11.1 13.83,24.53 v13.87,24.54 13.77,24.43 13.77,14.48 v14.07,14.17 | C9.1 21.64,23.28 21.64,24.08 | U3.10 21.15,2.1 v21.03,1.98 21.11,2.06 R1.1 28.98,2.06 v29.01,2.08 | U3.2 21.14,8.38 v19.61,8.38 17.02,8.38 16.31,7.67 v12.55,7.67 | R2.2 42.23,22.87 42.52,23.16 42.52,26.11 37.08,31.55 v37.08,33.58
  Top 0.406: 21.59,24.08 21.59,25.3 | JP1.2 13.87,29.15 v13.87,24.54
  Top 0.457: 22.83,21.93 U1.P9 21.91,21.93 21.59,22.25 21.59,24.08 | 22.1,31.62 SJ4.2 | SJ4.2 22.13,33.23 JP1.2 | 21.59,24.08 21.59,27.69 22.05,28.14 22.05,31.57 SJ4.2 | C8.2 22.63,24.61 22.1,24.08 21.64,24.08 21.59,24.08
  Bottom 0.203: v29.01,7.52 v29.01,2.08 | JP1.2 21.68,33.68 36.98,33.68 v37.08,33.58 | v12.55,7.67 14.07,9.2 v14.07,14.17
  Bottom 0.254: 20.07,35.36 JP1.2 | v19.61,8.38 21.03,6.96 v21.03,1.98
VDD_5V
  Top 0.61: SJ14.1 5.22,35.56 JP4.2
  Top 0.711: SJ14.1 9.27,35.56 10.59,36.88 12.32,36.88 12.81,37.37 U2.1 13.04,38.15 C6.2

### Text on the board
Top: TOP
Bottom: BOTTOM